# Altium schematic sheet Audio.SchDoc
size A3; Date: 27.05.2014; DrawnBy: luths8; Organization: BFH; Address1: Bern University of Applied Sciences; Address2: Engineering and Information Technology; Address3: Jlcoweg 1; Address4: CH-3400 Burgdorf; DocumentNumber: 8; Revision: 1.0; SheetNumber: 8; SheetTotal: 16; CurrentDate: 27.05.2014
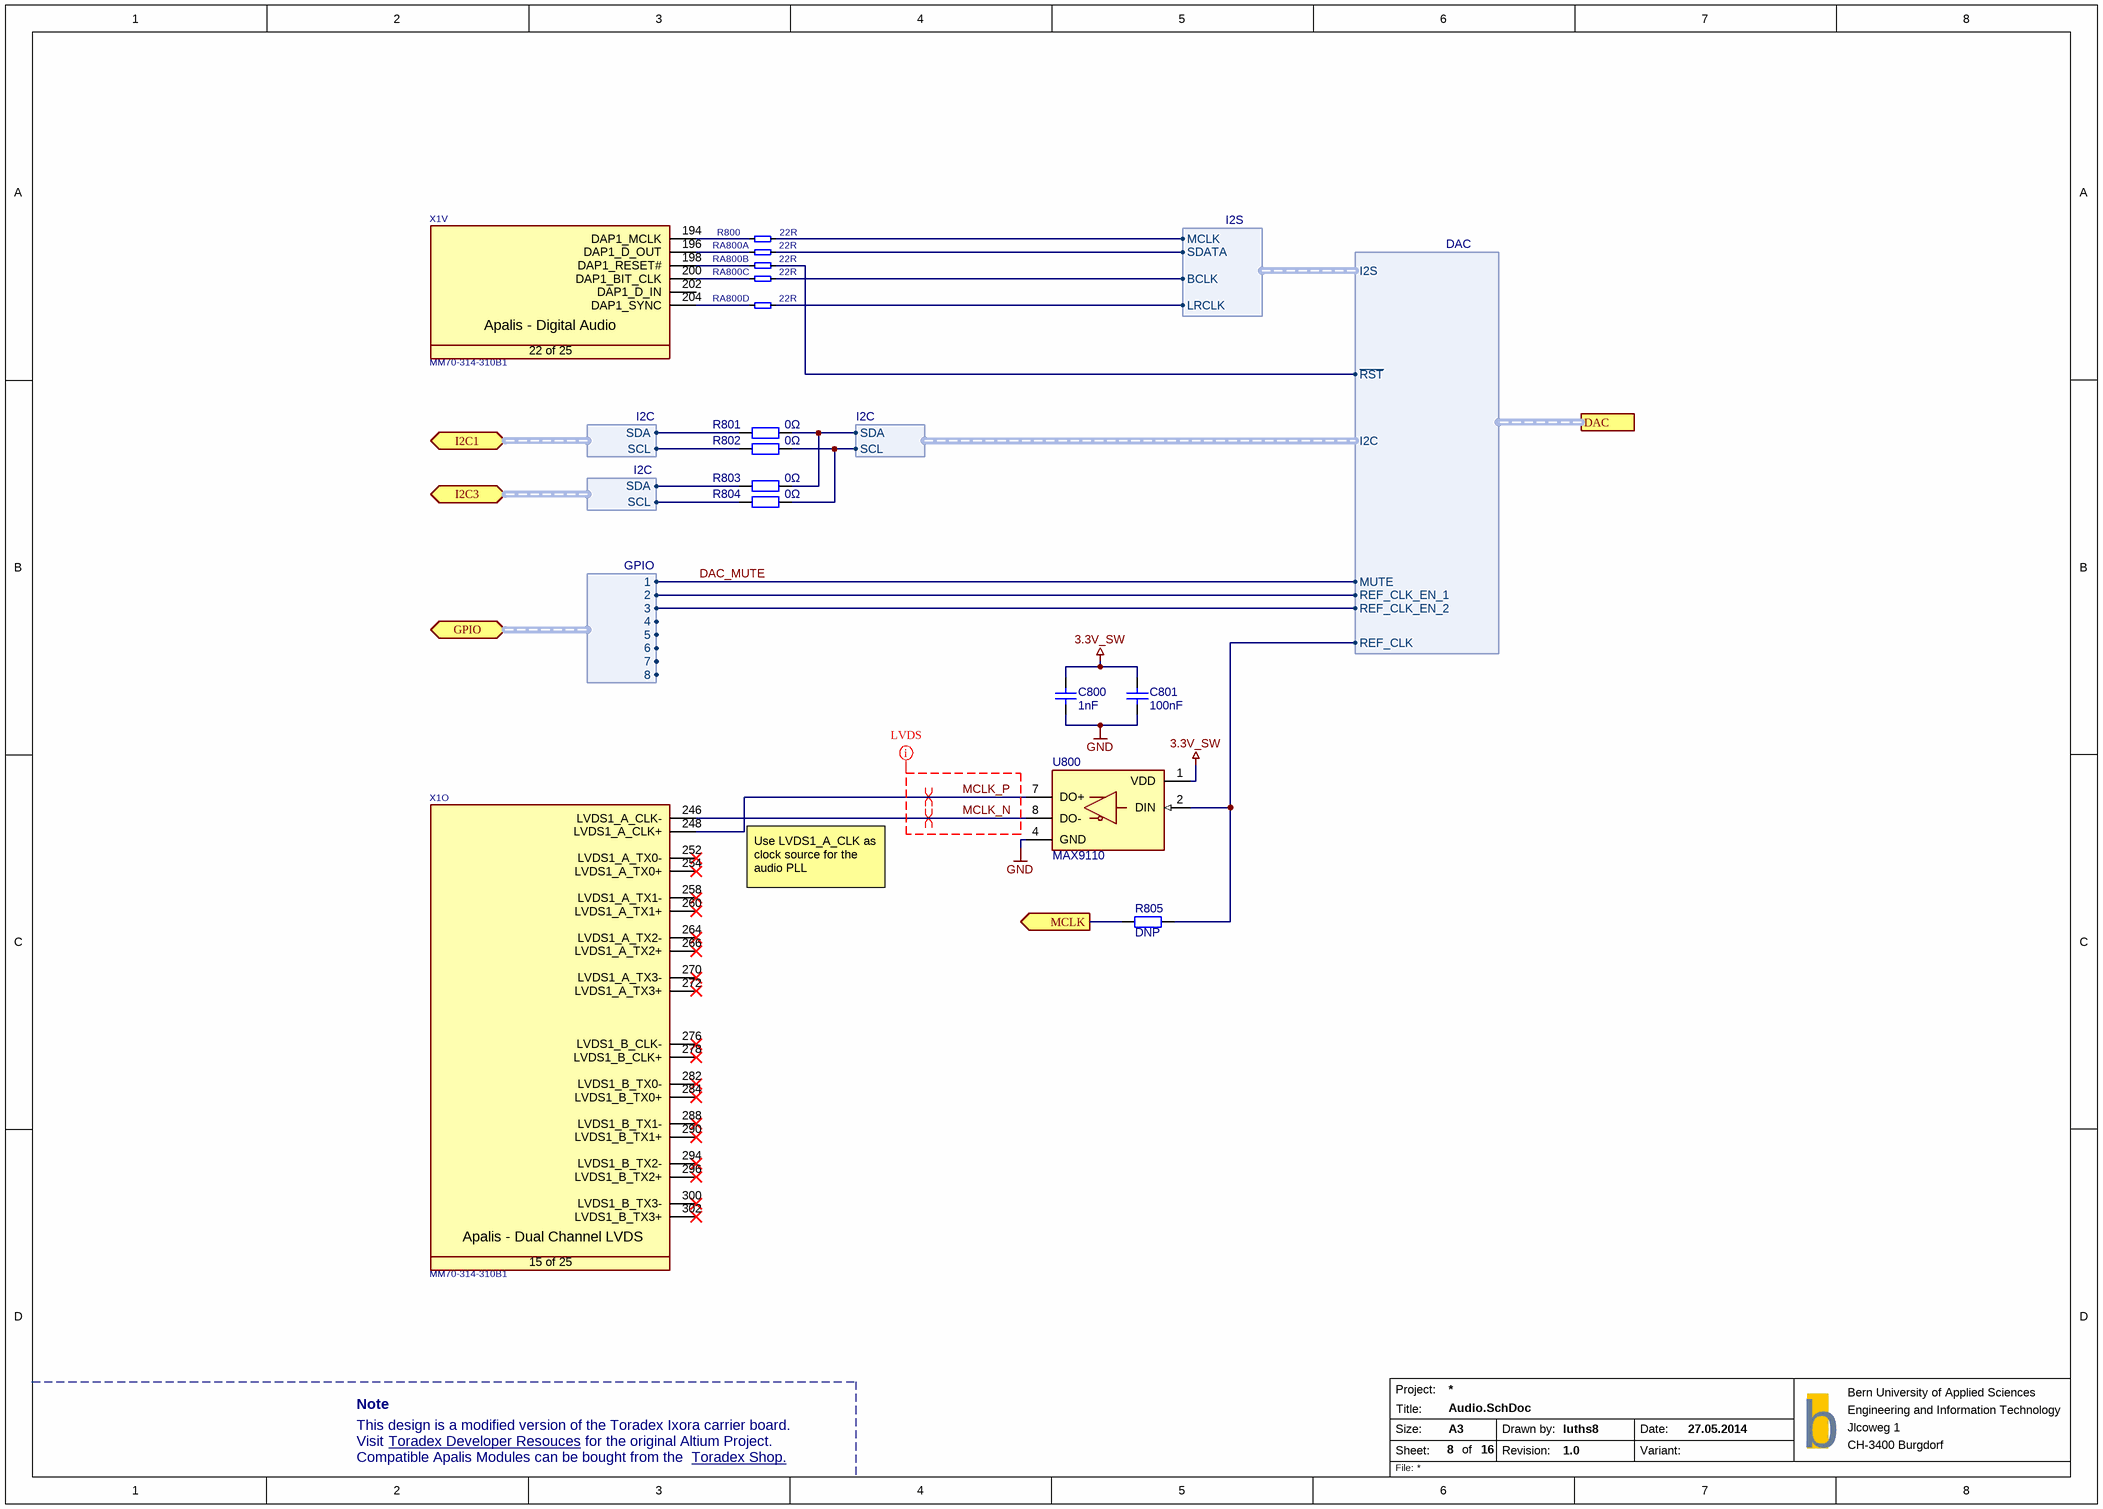
[diagram p0: Audio.SchDoc]

## Parts
C800  1nF  [SMD0603CAP]
C801  100nF  [SMD0603CAP]
R800  22R  [SMD0603RES]
R801  0Ω  [SMD0603RES]
R802  0Ω  [SMD0603RES]
R803  0Ω  [SMD0603RES]
R804  0Ω  [SMD0603RES]
R805  DNP  [SMD0603RES]
RA800  22R  [T_Resistor_Array_X4]  (parts A,B,C,D of 4)
U800  MAX9110  [SOIC8]
X1  Manufacturer Part No.: MM70-314-310B1  [T_JAE_MM70-314-310B1]  (hidden comment: CON-JAE-MM70-314-310B1-314-0.5mm)  (parts O,V of 25)

## Ports
DAC (harness DAC), GPIO (bidir, harness GPIO, see 12, 17, 19, 5), I2C1 (bidir, harness I2C, see 12, 17, 19, 5), I2C3 (bidir, harness I2C, see 12, 17, 19, 5), MCLK (out)

## Harnesses
I2S: MCLK, BCLK, LRCLK, SDATA
DAC: I2S, ~{RST}, I2C, MUTE, REF_CLK_EN_1, REF_CLK_EN_2, REF_CLK
I2C: SCL, SDA
GPIO: 1, 2, 3, 4, 5, 6, 7, 8

## Nets
3.3V_SW: C800.1 C801.1 U800.1(VDD)
GND: C800.2(q) C801.2(q) U800.4(GND)
DAC_MUTE: port DAC.MUTE, port GPIO.1
MCLK: R805.2 ; port MCLK
MCLK_N: U800.8(DO-) X1.246(LVDS1_A_CLK-)
MCLK_P: U800.7(DO+) X1.248(LVDS1_A_CLK+)
NetR800_1: R800.1 X1.194(DAP1_MCLK)
NetR800_2: R800.2 ; harness I2S.MCLK
NetR801_1: R801.1 R803.1 ; harness I2C.SDA
NetR801_2: R801.2 ; port I2C1.SDA
NetR802_1: R802.1 R804.1 ; harness I2C.SCL
NetR802_2: R802.2 ; port I2C1.SCL
NetR803_2: R803.2 ; port I2C3.SDA
NetR804_2: R804.2 ; port I2C3.SCL
NetR805_1: R805.1 U800.2(DIN) ; port DAC.REF_CLK
NetRA800_1: RA800.1 X1.196(DAP1_D_OUT)
NetRA800_2: RA800.2 X1.198(DAP1_RESET#)
NetRA800_3: RA800.3 X1.200(DAP1_BIT_CLK)
NetRA800_4: RA800.4 X1.204(DAP1_SYNC)
NetRA800_5: RA800.5 ; harness I2S.SDATA
NetRA800_6: RA800.6 ; port DAC.~{RST}
NetRA800_7: RA800.7 ; harness I2S.BCLK
NetRA800_8: RA800.8 ; harness I2S.LRCLK
(unnamed): port DAC.REF_CLK_EN_1, port GPIO.2
(unnamed): port DAC.REF_CLK_EN_2, port GPIO.3

Not connected (* = marked no-connect by the designer): X1 202(DAP1_D_IN) 252(LVDS1_A_TX0-)* 254(LVDS1_A_TX0+)* 258(LVDS1_A_TX1-)* 260(LVDS1_A_TX1+)* 264(LVDS1_A_TX2-)* 266(LVDS1_A_TX2+)* 270(LVDS1_A_TX3-)* 272(LVDS1_A_TX3+)* 276(LVDS1_B_CLK-)* 278(LVDS1_B_CLK+)* 282(LVDS1_B_TX0-)* 284(LVDS1_B_TX0+)* 288(LVDS1_B_TX1-)* 290(LVDS1_B_TX1+)* 294(LVDS1_B_TX2-)* 296(LVDS1_B_TX2+)* 300(LVDS1_B_TX3-)* 302(LVDS1_B_TX3+)*

## Layout directives
differential pair: MCLK_N, MCLK_P
net class LVDS: MCLK_N, MCLK_P

## Notes on the sheet
- Use LVDS1_A_CLK as clock source for the audio PLL
- Note
- This design is a modified version of the Toradex Ixora carrier board.
- Visit
- Compatible Apalis Modules can be bought from the
- Toradex Developer Resouces <https://developer.toradex.com/products/ixora-carrier-board>
- for the original Altium Project.
- Toradex Shop. <https://www.toradex.com/order-now/apalis-arm-family>
- Project:
- Size:
- Sheet:
- Title:
- A3
- of
- Drawn by:
- Revision:
- Date:
- Variant:
- b
- File:
- (in symbol CON-JAE-MM70-314-310B1-314-0.5mm, part O) Apalis - Dual Channel LVDS; 15 of 25
- (in symbol CON-JAE-MM70-314-310B1-314-0.5mm, part V) Apalis - Digital Audio; 22 of 25

## Library data of the parts
C800 C801 = Capacitor Ceramic: Ceramic Capacitor; Voltage: *; Manufacturer Part No.: *
R800 = R-22R-63mW-5%-0402: Resistor 22 ohm 63mW 5% 0603; Rating: 63mW; Tolerance: 5%; Value: 22R
R801-R805 = Resistor: Manufacturer Part No.: *
RA800 = RA-22R-63mW-5%-1206-div: Resistor Array 22 R 63mW 5% 1206; Tolerance: 5%; Power Dissipation: 63mW; Value: 22R
U800 = MAX9110: LVDS Transmitter; Manufacturer Part No.: MAX9110ESA+
X1 = CON-JAE-MM70-314-310B1-314-0.5mm: MXM3 Connector; Manufacturer Name: JAE; No. of ways: 314